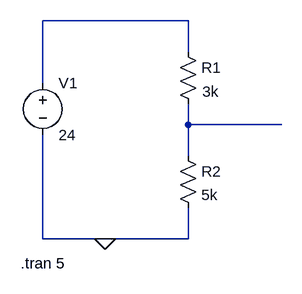
[diagram p0: schematic Draft1.asc]
Draft1.asc, the LTspice schematic file:
Version 4
SHEET 1 880 680
WIRE 64 80 -160 80
WIRE 64 128 64 80
WIRE -160 176 -160 80
WIRE 64 240 64 208
WIRE 208 240 64 240
WIRE 64 288 64 240
WIRE -160 416 -160 256
WIRE -64 416 -160 416
WIRE 64 416 64 368
WIRE 64 416 -64 416
FLAG -64 416 0
SYMBOL voltage -160 160 R0
WINDOW 123 0 0 Left 0
WINDOW 39 0 0 Left 0
SYMATTR InstName V1
SYMATTR Value 24
SYMBOL res 48 112 R0
WINDOW 3 38 77 Left 2
SYMATTR InstName R1
SYMATTR Value 3k
SYMBOL res 48 272 R0
SYMATTR InstName R2
SYMATTR Value 5k
TEXT -194 454 Left 2 !.tran 5

The netlist it stands for:
* Draft1.asc
V1 N001 0 24
R1 N001 N002 3k
R2 N002 0 5k
.tran 5
.backanno
.end